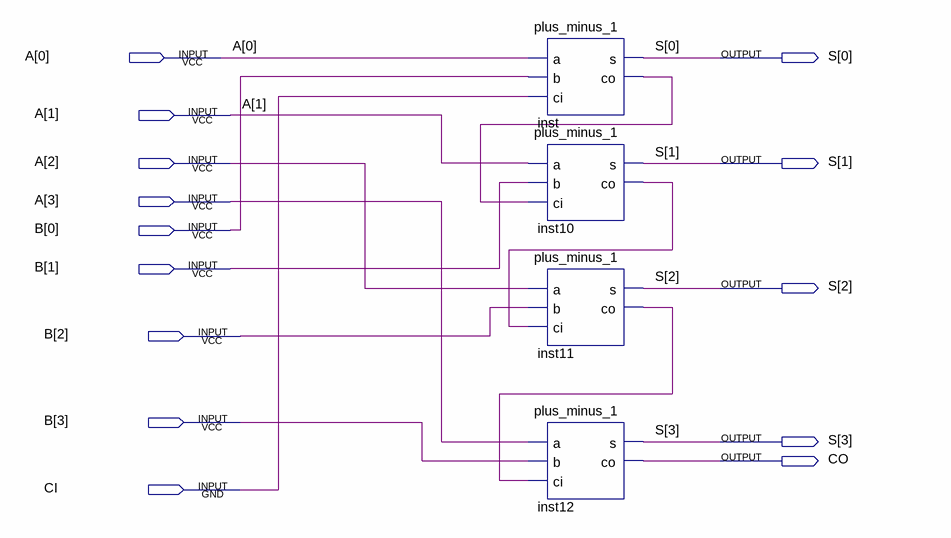
[diagram p0: schematic sheet]
// Quartus schematic plus_4.bdf as structural Verilog: 4 symbols, 14 pins
module plus_4 (
  input  [3:0] A,
  input  [3:0] B,
  input  CI,
  output [3:0] S,
  output CO
);

  wire inst10_co, inst11_co, inst_co;

  plus_minus_1 inst (.a(A[0]), .b(B[0]), .ci(CI), .s(S[0]), .co(inst_co));
  plus_minus_1 inst10 (.a(A[1]), .b(B[1]), .ci(inst_co), .s(S[1]), .co(inst10_co));
  plus_minus_1 inst11 (.a(A[2]), .b(B[2]), .ci(inst10_co), .s(S[2]), .co(inst11_co));
  plus_minus_1 inst12 (.a(A[3]), .b(B[3]), .ci(inst11_co), .s(S[3]), .co(CO));
endmodule
